# Altium schematic sheet Power.SchDoc: OtterControl
size A4; Address4: Niklas Fauth
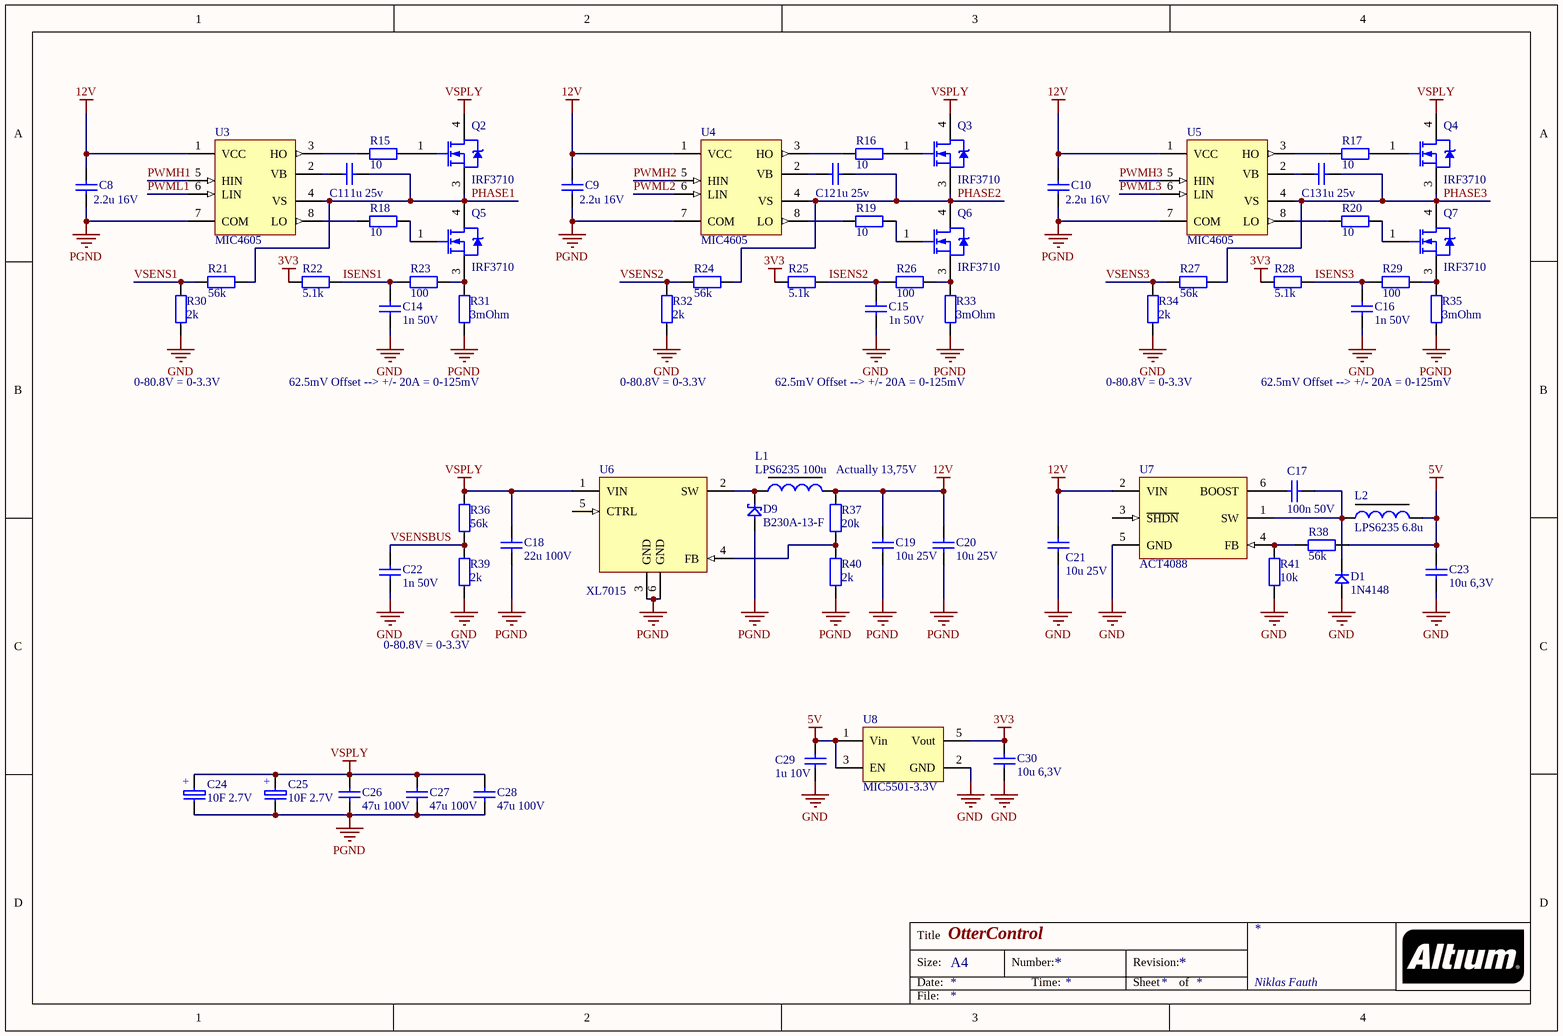
[diagram p0: Power.SchDoc]

## Parts
C8  2.2u 16V  [C-0603-M]
C9  2.2u 16V  [C-0603-M]
C10  2.2u 16V  [C-0603-M]
C11  1u 25v  [C-0603-H]
C12  1u 25v  [C-0603-H]
C13  1u 25v  [C-0603-H]
C14  1n 50V  [C-0603-H]
C15  1n 50V  [C-0603-H]
C16  1n 50V  [C-0603-H]
C17  100n 50V  [C-0603-H]
C18  22u 100V  [C-2220]
C19  10u 25V  [C-1206-H]
C20  10u 25V  [C-1206-H]
C21  10u 25V  [C-1206-H]
C22  1n 50V  [C-0603-H]
C23  10u 6,3V  [C-0603-H]
C24  10F 2.7V  [12.5x31.5-angle]
C25  10F 2.7V  [12.5x31.5-angle]
C26  47u 100V  [C-2220]
C27  47u 100V  [C-2220]
C28  47u 100V  [C-2220]
C29  1u 10V  [C-0603-M]
C30  10u 6,3V  [C-0603-H]
D1  1N4148  [SOD323F]
D9  B230A-13-F  [DIODE-SMA]
L1  LPS6235 100u  [LPS6235]
L2  LPS6235 6.8u  [LPS6235]
Q2  IRF3710  [ONSC-D2PAK-3-418B-04_V]
Q3  IRF3710  [ONSC-D2PAK-3-418B-04_V]
Q4  IRF3710  [ONSC-D2PAK-3-418B-04_V]
Q5  IRF3710  [ONSC-D2PAK-3-418B-04_V]
Q6  IRF3710  [ONSC-D2PAK-3-418B-04_V]
Q7  IRF3710  [ONSC-D2PAK-3-418B-04_V]
R15  10  [R-0603-H]
R16  10  [R-0603-H]
R17  10  [R-0603-H]
R18  10  [R-0603-H]
R19  10  [R-0603-H]
R20  10  [R-0603-H]
R21  56k  [R-0603-H]
R22  5.1k  [R-0603-H]
R23  100  [R-0603-H]
R24  56k  [R-0603-H]
R25  5.1k  [R-0603-H]
R26  100  [R-0603-H]
R27  56k  [R-0603-H]
R28  5.1k  [R-0603-H]
R29  100  [R-0603-H]
R30  2k  [R-0603-M]
R31  3mOhm  [R-1206-M]
R32  2k  [R-0603-M]
R33  3mOhm  [R-1206-M]
R34  2k  [R-0603-M]
R35  3mOhm  [R-1206-M]
R36  56k  [R-0603-H]
R37  20k  [R-0603-H]
R38  56k  [R-0603-H]
R39  2k  [R-0603-M]
R40  2k  [R-0603-H]
R41  10k  [R-0603-H]
U3  MIC4605  [SOIC-8]
U4  MIC4605  [SOIC-8]
U5  MIC4605  [SOIC-8]
U6  XL7015  [DPAK127P970X238-6L]
U7  ACT4088  [SOT23-6]
U8  MIC5501-3.3V  [SOT23-5]

## Nets
3V3: C30.2 R22.1 R25.1 R28.1 U8.5(Vout)
5V: C23.2 C29.2 L2.2 R38.2 U8.1(Vin) U8.3(EN)
12V: C8.2 C9.2 C10.2 C19.2 C20.2 C21.2 L1.2 R37.2 U3.1(VCC) U4.1(VCC) U5.1(VCC) U7.2(VIN)
GND: C14.1 C15.1 C16.1 C21.1 C22.1 C23.1 C29.1 C30.1 D1.1(an) R30.1 R32.1 R34.1 R39.1 R41.1 U7.5(GND) U8.2(GND)
PGND: C8.1 C9.1 C10.1 C18.1 C19.1 C20.1 C24.2 C25.2 C26.1 C27.1 C28.1 D9.1(an) R31.1 R33.1 R35.1 R40.1 U3.7(COM) U4.7(COM) U5.7(COM) U6.3(GND) U6.6(GND)
VSPLY: C18.2 C24.1 C25.1 C26.2 C27.2 C28.2 Q2.4(D) Q3.4(D) Q4.4(D) R36.2 U6.1(VIN)
ISENS1: C14.2 R22.2 R23.1
ISENS2: C15.2 R25.2 R26.1
ISENS3: C16.2 R28.2 R29.1
PHASE1: C11.2 Q2.3(S) Q5.4(D) R21.2 U3.4(VS)
PHASE2: C12.2 Q3.3(S) Q6.4(D) R24.2 U4.4(VS)
PHASE3: C13.2 Q4.3(S) Q7.4(D) R27.2 U5.4(VS)
PWMH1: U3.5(HIN)
PWMH2: U4.5(HIN)
PWMH3: U5.5(HIN)
PWML1: U3.6(LIN)
PWML2: U4.6(LIN)
PWML3: U5.6(LIN)
VSENS1: R21.1 R30.2
VSENS2: R24.1 R32.2
VSENS3: R27.1 R34.2
VSENSBUS: C22.2 R36.1 R39.2
NetC11_1: C11.1 U3.2(VB)
NetC12_1: C12.1 U4.2(VB)
NetC13_1: C13.1 U5.2(VB)
NetC17_1: C17.1 U7.6(BOOST)
NetC17_2: C17.2 D1.2(kt) L2.1 U7.1(SW)
NetD9_2: D9.2(kt) L1.1 U6.2(SW)
NetQ2_1: Q2.1(G) R15.2
NetQ3_1: Q3.1(G) R16.2
NetQ4_1: Q4.1(G) R17.2
NetQ5_1: Q5.1(G) R18.2
NetQ5_3: Q5.3(S) R23.2 R31.2
NetQ6_1: Q6.1(G) R19.2
NetQ6_3: Q6.3(S) R26.2 R33.2
NetQ7_1: Q7.1(G) R20.2
NetQ7_3: Q7.3(S) R29.2 R35.2
NetR15_1: R15.1 U3.3(HO)
NetR16_1: R16.1 U4.3(HO)
NetR17_1: R17.1 U5.3(HO)
NetR18_1: R18.1 U3.8(LO)
NetR19_1: R19.1 U4.8(LO)
NetR20_1: R20.1 U5.8(LO)
NetR37_1: R37.1 R40.2 U6.4(FB)
NetR38_1: R38.1 R41.2 U7.4(FB)

Not connected (* = marked no-connect by the designer): U6 5(CTRL); U7 3(~{SHDN})

## Notes on the sheet
- 0-80.8V = 0-3.3V
- 62.5mV Offset --> +/- 20A = 0-125mV
- Actually 13,75V
- Title
- Size:
- Date:
- A4
- Number:
- Time:
- Revision:
- Sheet
- of
- File:
- (in symbol SC-10F-2.7V) +

## Library data of the parts
C8-C10 = C-0603-2u2-16V: Capacitor 2.2uF 16V; Supplier 1: Mouser; Supplier Part Number 1: 80-C0603C225K4P
C11-C13 = C-0603-1u-25V: Capacitor 1uF 25V; Supplier 1: Mouser; Supplier Part Number 1: 80-C0603C105K3R
C14-C16 C22 = C-0603-1n-50V: Capacitor 1nF 50V; Supplier 1: Mouser; Supplier Part Number 1: 80-C0603C102J5G
C17 = C-0603-100n-50V: Capacitor 100n 50V; Supplier 1: Mouser; Supplier Part Number 1: 80-C0603C104K5RAUTO
C18 C26-C28 = C-2220-15u-100V: Capacitor 47uF 100V
C19-C21 = C-1206-10u-25V: Capacitor 10uF 25V; Supplier 1: Mouser; Supplier Part Number 1: 80-C1206C106K3P
C23 C30 = C-0603-10u-6,3V: Capacitor 10uF 6,3V; Supplier 1: Mouser; Supplier Part Number 1: 80-C0603C106M9P
C24 C25 = SC-10F-2.7V: supercap 10F 2.7V; Supplier 1: Mouser; Supplier Part Number 1: 647-JUMT1106MHD
C29 = C-0603-1u-10V: Capacitor 1uF 10V; Supplier 1: Mouser; Supplier Part Number 1: 80-C0603C105K8P
D1 = 1N4148: Diode 1N4148; Supplier 1: Mouser; Supplier Part Number 1: 512-1N4148WS
D9 = D-B230A-13-F: Supplier 1: Mouser; Supplier Part Number 1: 621-B230A-F
L1 = L-LPS6235-68u: Supplier 1: Mouser; Supplier Part Number 1: 994-LPS6235-683MRC
L2 = L-LPS6235-6u8: Supplier 1: Mouser; Supplier Part Number 1: 994-LPS6235-682MRB
Q2-Q7 = CMP-1058-00095-1: Power MOSFET, 37 A, 150 V, N-Channel Enhancement-Mode, 3-Pin D2PAK, Pb-Free, Tube; Manufacturer: On Semiconductor; PartNumber: NTB35N15G; VGS(th) Max (V): 4; Ciss Typ (pF): 2275; V(BR)DSS Min (V): 150; Channel Polarity: N Channel; Crss Typ (pF): 90; VGS Max (V): 20; Qrr Typ (nC): 1140; Coss Typ (pF): 450; Configuration: Single; ComponentLink2Description: Datasheet; ComponentLink3URL: http://www.onsemi.com/pub_link/Collateral/418B-04.PDF; RoHS: Pb-Free; PackageVersion: Rev. K, 09/2008; DatasheetVersion: Rev. 5; Mounting Technology: Surface Mount; ComponentLink1URL: http://www.onsemi.com/; PackageReference: D2PAK-3-418B-04; Package Type: D2PAK-3; ComponentLink2URL: http://www.onsemi.cn/pub_link/Collateral/NTB35N15-D.PDF; PackageDescription: 3-Pin Flange Mount, Body 9.145 x 9.97 mm, Pitch 2.54 mm; ComponentLink3Description: Package Specification; Packing: Tube; ComponentLink1Description: Manufacturer URL
R15-R20 = R-0603-10: Resistor 10; Supplier 1: Mouser; Supplier Part Number 1: 71-CRCW0603-10-E3
R21 R24 R27 R36 R38 = R-0603-47k: Resistor 4k7; Supplier 1: Mouser; Supplier Part Number 1: 71-CRCW060347K0FKEB
R22 R25 R28 = R-0603-5k1: Resistor 5.1k; Supplier 1: Mouser; Supplier Part Number 1: 71-CRCW0603-5.1K-E3
R23 R26 R29 = R-0603-100: Resistor 100; Supplier 1: Mouser; Supplier Part Number 1: 71-CRCW0603-100-E3
R30 R32 R34 R39 R40 = R-0603-2k: Resistor 2k; Supplier 1: Mouser; Supplier Part Number 1: 71-CRCW0603-12.1K-E3
R31 R33 R35 = R-1206-0: Resistor 0; Supplier 1: Mouser; Supplier Part Number 1: 71-CRCW1206-0-E3
R37 = R-0603-20k: Resistor 20k; Resistance: 20k; Supplier 1: Mouser; Supplier Part Number 1: 71-CRCW0603-20K-E3
R41 = R-0603-15k: Resistor 15k; Supplier 1: Mouser; Supplier Part Number 1: 71-CRCW0603-15K-E3
U6 = XL7015: High Voltage StepDown
U8 = MIC5501-3.3V: Supplier 1: Mouser; Supplier Part Number 1: 998-MIC5501-3.0YM5TR